# Altium project LimeSDR_1v2.PrjPcb (part 2 of 2)

## Sheet 13_Clocks.SchDoc: Clocks
size A3; Organization: Lime Microsystems; Address1: Surrey Tech Centre; Address2: Guildford GU2 7YG; Address3: Surrey; Address4: United Kingdom; Revision: v1.2; SheetNumber: 13; SheetTotal: 14
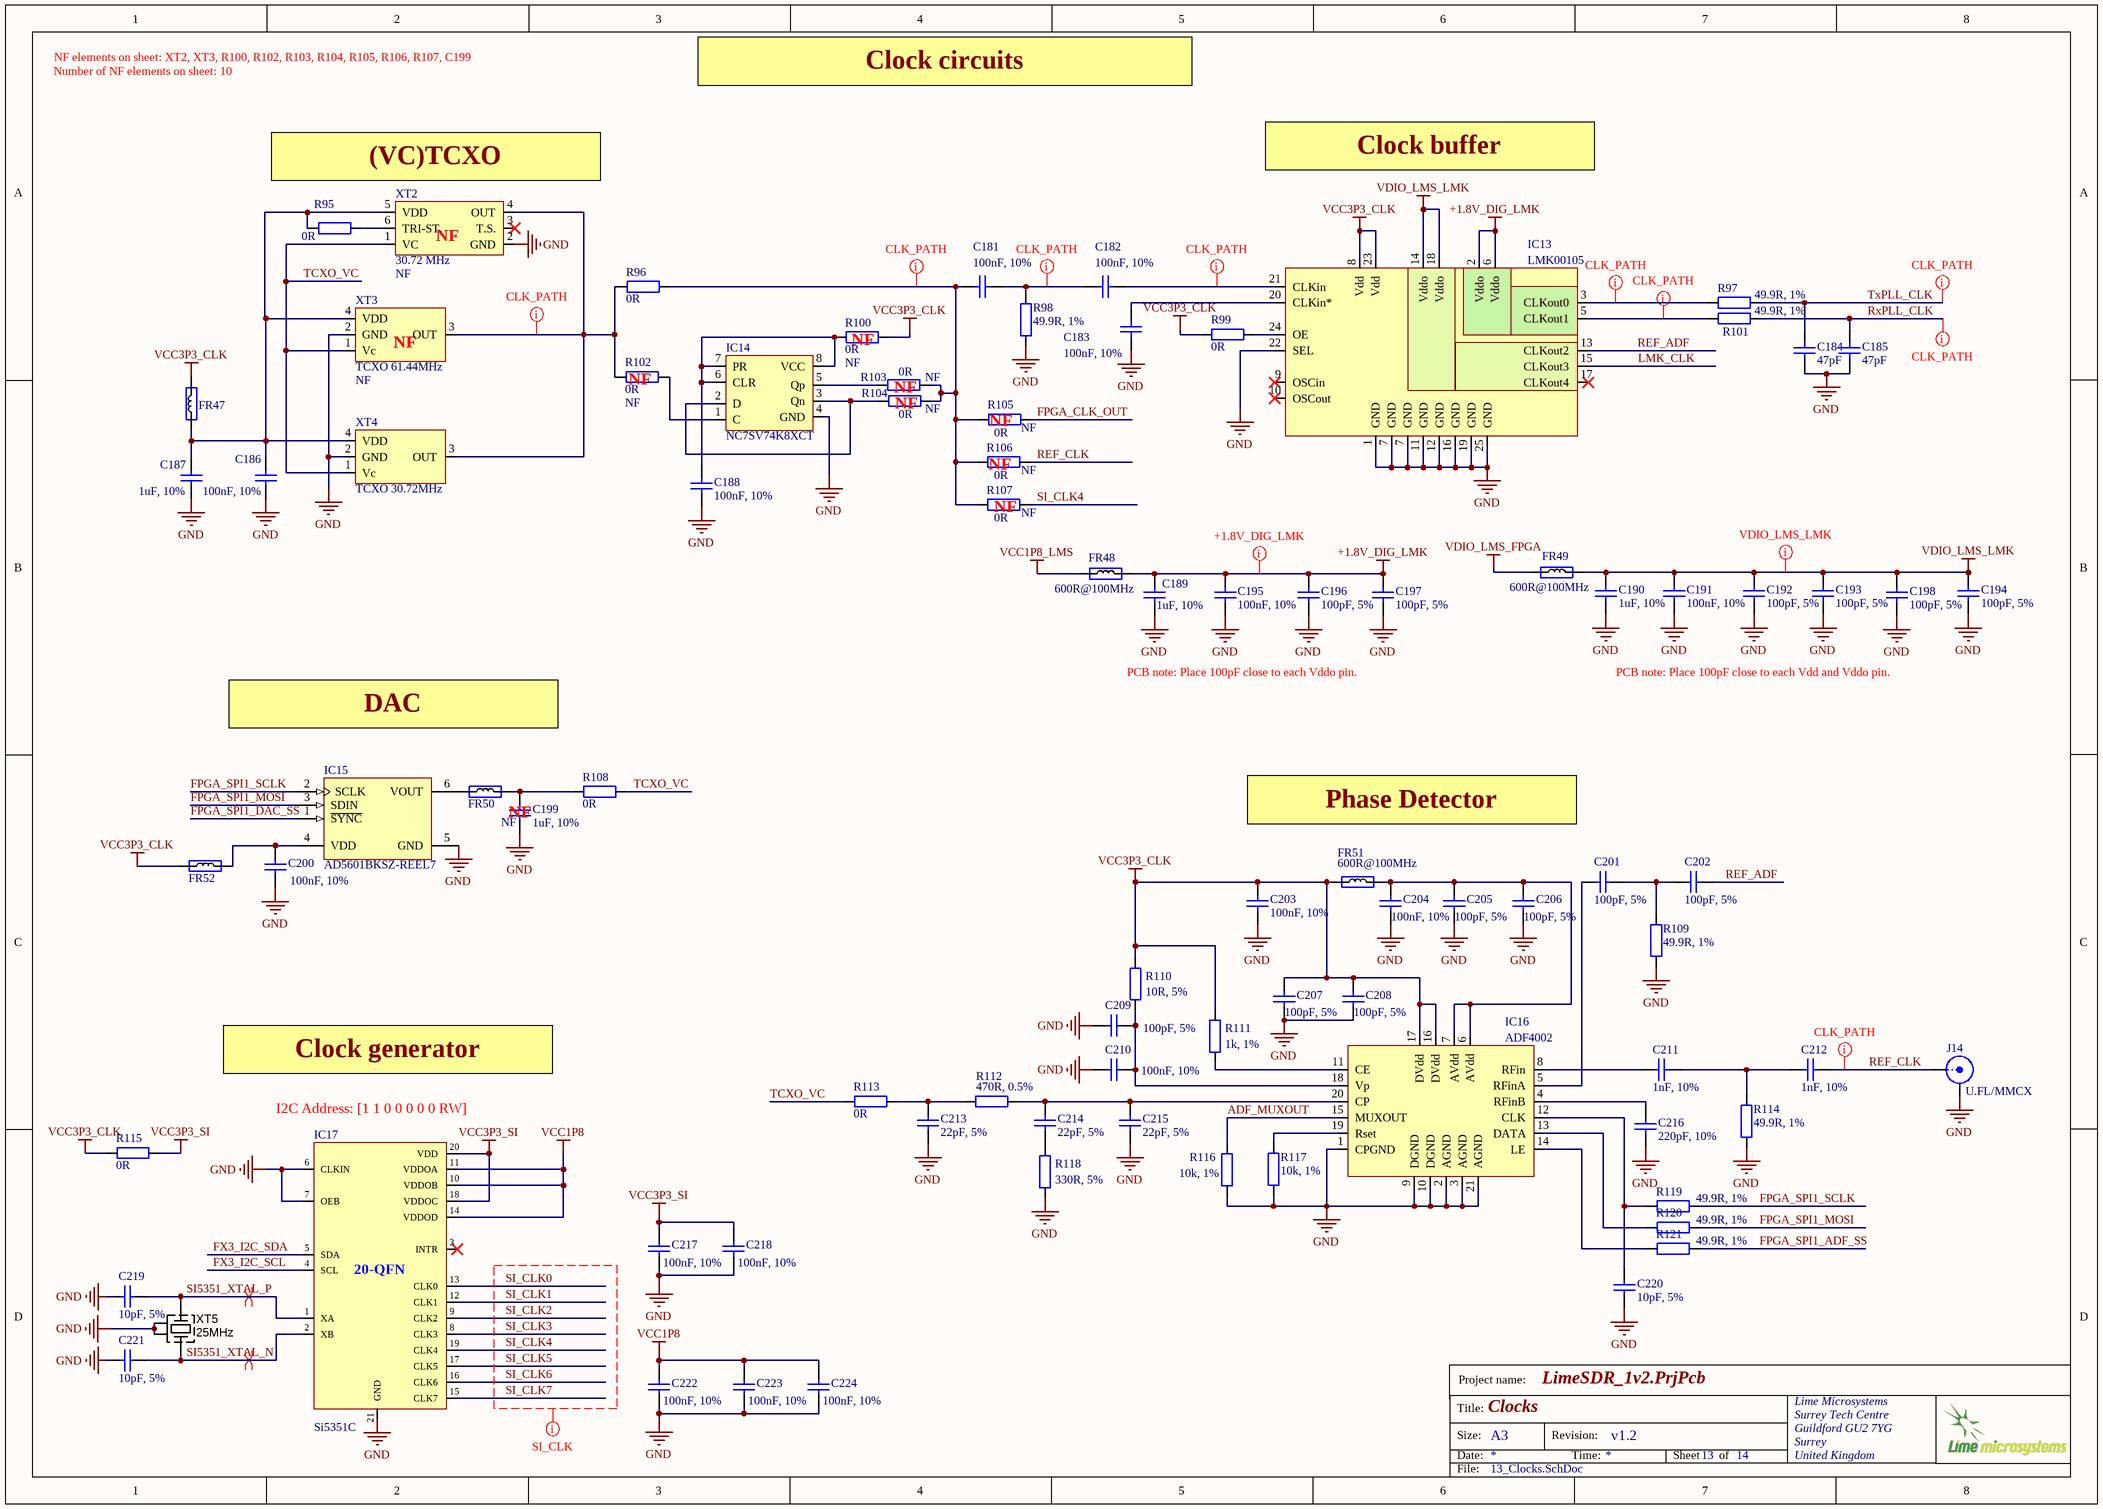
[diagram p7: 13_Clocks.SchDoc]

### Parts
C181  100nF, 10%  [CAP0402]
C182  100nF, 10%  [CAP0402]
C183  100nF, 10%  [CAP0402]
C184  47pF  [CAP0402]
C185  47pF  [CAP0402]
C186  100nF, 10%  [CAP0402]
C187  1uF, 10%  [CAP0402]
C188  100nF, 10%  [CAP0402]
C189  1uF, 10%  [CAP0402]
C190  1uF, 10%  [CAP0402]
C191  100nF, 10%  [CAP0402]
C192  100pF, 5%  [CAP0402]
C193  100pF, 5%  [CAP0402]
C194  100pF, 5%  [CAP0402]
C195  100nF, 10%  [CAP0402]
C196  100pF, 5%  [CAP0402]
C197  100pF, 5%  [CAP0402]
C198  100pF, 5%  [CAP0402]
C199  1uF, 10%  Assembly Info: NF  [CAP0402]
C200  100nF, 10%  [CAP0402]
C201  100pF, 5%  [CAP0402]
C202  100pF, 5%  [CAP0402]
C203  100nF, 10%  [CAP0402]
C204  100nF, 10%  [CAP0402]
C205  100pF, 5%  [CAP0402]
C206  100pF, 5%  [CAP0402]
C207  100pF, 5%  [CAP0402]
C208  100pF, 5%  [CAP0402]
C209  100pF, 5%  [CAP0402]
C210  100nF, 10%  [CAP0402]
C211  1nF, 10%  [CAP0402]
C212  1nF, 10%  [CAP0402]
C213  22pF, 5%  [CAP0402]
C214  22pF, 5%  [CAP0402]
C215  22pF, 5%  [CAP0402]
C216  220pF, 10%  [CAP0402]
C217  100nF, 10%  [CAP0402]
C218  100nF, 10%  [CAP0402]
C219  10pF, 5%  [CAP0402]
C220  10pF, 5%  [CAP0402]
C221  10pF, 5%  [CAP0402]
C222  100nF, 10%  [CAP0402]
C223  100nF, 10%  [CAP0402]
C224  100nF, 10%  [CAP0402]
FR47  Ferrite  [RES0201]  (value not drawn)
FR48  600R@100MHz  [RES0805]
FR49  600R@100MHz  [RES0805]
FR50  Ferrite  [RES0201]  (value not drawn)
FR51  600R@100MHz  [RES0805]
FR52  Ferrite  [RES0201]  (value not drawn)
IC13  LMK00105  [LMK00105SQ]
IC14  NC7SV74K8XCT  [NC7SV74K8XCT]
IC15  AD5601BKSZ-REEL7  [AD5601_SOT23-6]
IC16  ADF4002  [ADF4002]
IC17  Si5351C  [Si5351C_20QFN]
J14  U.FL/MMCX  [MMCX_UFL_conn_u]
R95  0R  [RES0402]
R96  0R  [RES0402]
R97  49.9R, 1%  [RES0402]
R98  49.9R, 1%  [RES0402]
R99  0R  [RES0402]
R100  0R  Assembly Info: NF  [RES0402]
R101  49.9R, 1%  [RES0402]
R102  0R  Assembly Info: NF  [RES0402]
R103  0R  Assembly Info: NF  [RES0402]
R104  0R  Assembly Info: NF  [RES0402]
R105  0R  Assembly Info: NF  [RES0402]
R106  0R  Assembly Info: NF  [RES0402]
R107  0R  Assembly Info: NF  [RES0402]
R108  0R  [RES0402]
R109  49.9R, 1%  [RES0402]
R110  10R, 5%  [RES0402]
R111  1k, 1%  [RES0402]
R112  470R, 0.5%  [RES0402]
R113  0R  [RES0402]
R114  49.9R, 1%  [RES0402]
R115  0R  [RES0402]
R116  10k, 1%  [RES0402]
R117  10k, 1%  [RES0402]
R118  330R, 5%  [RES0402]
R119  49.9R, 1%  [RES0402]
R120  49.9R, 1%  [RES0402]
R121  49.9R, 1%  [RES0402]
XT2  30.72 MHz  Assembly Info: NF  [RAKON_RPT7050A]
XT3  TCXO 61.44MHz  Assembly Info: NF  [RAKON_TXCO_61MHz_v2]
XT4  TCXO 30.72MHz  [RAKON_TXCO]
XT5  25MHz  [CRYSTAL_4-LCC]

### Nets
+1.8V_DIG_LMK: C189.2 C195.2 C196.2 C197.2 FR48.2 IC13.2(Vddo) IC13.6(Vddo)
GND: C183.1 C184.1 C185.1 C186.1 C187.1 C188.1 C189.1 C190.1 C191.1 C192.1 C193.1 C194.1 C195.1 C196.1 C197.1 C198.1 C199.1 C200.2 C203.1 C204.1 C205.2 C206.2 C207.2 C208.2 C209.1 C210.2 C213.1 C215.1 C216.2 C217.2 C218.2 C219.1 C220.1 C221.1 C222.2 C223.2 C224.2 IC13.1(GND) IC13.7(GND) IC13.11(GND) IC13.12(GND) IC13.16(GND) IC13.19(GND) IC13.22(SEL) IC13.25(GND) IC14.4(GND) IC15.5(GND) IC16.1(CPGND) IC16.2(AGND) IC16.3(AGND) IC16.9(DGND) IC16.10(DGND) IC16.21(AGND) IC17.6(CLKIN) IC17.7(OEB) IC17.21(GND) J14.2(Y) R98.1 R109.1 R114.1 R116.2 R117.2 R118.1 XT2.2(GND) XT3.2(GND) XT4.2(GND) XT5.2(GND) XT5.4(GND)
VCC1P8: C222.1 C223.1 C224.1 IC17.10(VDDOB) IC17.11(VDDOA) IC17.14(VDDOD)
VCC1P8_LMS: FR48.1
VCC3P3_CLK: C203.2 C207.1 C208.1 FR47.2 FR51.1 FR52.1 IC13.8(Vdd) IC13.23(Vdd) IC16.16(DVdd) IC16.17(DVdd) R99.1 R100.1 R110.2 R111.2 R115.2
VCC3P3_SI: C217.1 C218.1 IC17.18(VDDOC) IC17.20(VDD) R115.1
VDIO_LMS_FPGA: FR49.1
VDIO_LMS_LMK: C190.2 C191.2 C192.2 C193.2 C194.2 C198.2 FR49.2 IC13.14(Vddo) IC13.18(Vddo)
ADF_MUXOUT: IC16.15(MUXOUT) R116.1
FPGA_CLK_OUT: R105.1
FPGA_SPI1_ADF_SS: R121.1
FPGA_SPI1_DAC_SS: IC15.1(~{SYNC})
FPGA_SPI1_MOSI: IC15.3(SDIN) R120.1
FPGA_SPI1_SCLK: IC15.2(SCLK) R119.1
FX3_I2C_SCL: IC17.4(SCL)
FX3_I2C_SDA: IC17.5(SDA)
LMK_CLK: IC13.15(CLKout3)
REF_ADF: C202.2 IC13.13(CLKout2)
REF_CLK: C212.1 J14.1(X) R106.2
RxPLL_CLK: C185.2 R101.1
SI5351_XTAL_N: C221.2 IC17.2(XB) XT5.3(X)
SI5351_XTAL_P: C219.2 IC17.1(XA) XT5.1(X)
SI_CLK0: IC17.13(CLK0)
SI_CLK1: IC17.12(CLK1)
SI_CLK2: IC17.9(CLK2)
SI_CLK3: IC17.8(CLK3)
SI_CLK4: IC17.19(CLK4) R107.2
SI_CLK5: IC17.17(CLK5)
SI_CLK6: IC17.16(CLK6)
SI_CLK7: IC17.15(CLK7)
TCXO_VC: R108.1 R113.2 XT2.1(VC) XT3.1(Vc) XT4.1(Vc)
TxPLL_CLK: C184.2 R97.1
NetC181_1: C181.1 C182.2 R98.2
NetC181_2: C181.2 R96.1 R103.1 R104.1 R105.2 R106.1 R107.1
NetC182_1: C182.1 IC13.21(CLKin)
NetC183_2: C183.2 IC13.20(CLKin*)
NetC186_2: C186.2 C187.2 FR47.1 R95.2 XT2.5(VDD) XT3.4(VDD) XT4.4(VDD)
NetC188_2: C188.2 IC14.6(CLR) IC14.7(PR) IC14.8(VCC) R100.2
NetC199_2: C199.2 FR50.2 R108.2
NetC200_1: C200.1 FR52.2 IC15.4(VDD)
NetC201_1: C201.1 IC16.5(RFinA)
NetC201_2: C201.2 C202.1 R109.2
NetC204_2: C204.2 C205.1 C206.1 FR51.2 IC16.6(AVdd) IC16.7(AVdd)
NetC209_2: C209.2 C210.1 IC16.18(Vp) R110.1
NetC211_1: C211.1 C212.2 R114.2
NetC211_2: C211.2 IC16.8(RFin)
NetC213_2: C213.2 R112.2 R113.1
NetC214_1: C214.1 R118.2
NetC214_2: C214.2 C215.2 IC16.20(CP) R112.1
NetC216_1: C216.1 IC16.4(RFinB)
NetC220_2: C220.2 IC16.12(CLK) R119.2
NetFR50_1: FR50.1 IC15.6(VOUT)
NetIC13_3: IC13.3(CLKout0) R97.2
NetIC13_5: IC13.5(CLKout1) R101.2
NetIC13_24: IC13.24(OE) R99.2
NetIC14_1: IC14.1(C) R102.1
NetIC14_2: IC14.2(D) IC14.3(Qn) R104.2
NetIC14_5: IC14.5(Qp) R103.2
NetIC16_11: IC16.11(CE) R111.1
NetIC16_13: IC16.13(DATA) R120.2
NetIC16_14: IC16.14(LE) R121.2
NetIC16_19: IC16.19(Rset) R117.1
NetR95_1: R95.1 XT2.6(TRI-ST.)
NetR96_2: R96.2 R102.2 XT2.4(OUT) XT3.3(OUT) XT4.3(OUT)

Not connected (* = marked no-connect by the designer): IC13 9(OSCin)* 10(OSCout)* 17(CLKout4)*; IC17 3(INTR)*; XT2 3(T.S.)*

### Layout directives
net class CLK_PATH: NetC181_1, NetC181_2, NetC182_1, NetIC13_3, NetIC13_5, NetR96_2, REF_CLK, RxPLL_CLK, TxPLL_CLK
net class SI_CLK: SI_CLK0, SI_CLK1, SI_CLK2, SI_CLK3, SI_CLK4, SI_CLK5, SI_CLK6, SI_CLK7
differential pair: SI5351_XTAL_N, SI5351_XTAL_P
net class +1.8V_DIG_LMK: +1.8V_DIG_LMK
net class VDIO_LMS_LMK: VDIO_LMS_LMK

### Notes on the sheet
- Number of NF elements on sheet: 10
- NF elements on sheet: XT2, XT3, R100, R102, R103, R104, R105, R106, R107, C199
- Clock circuits
- (VC)TCXO
- Clock buffer
- (near XT2) NF
- (near XT3) NF
- (near R102) NF
- (near R100) NF
- NF
- (near R104) NF
- (near R105) NF
- (near R106) NF
- (near R107) NF
- PCB note: Place 100pF close to each Vddo pin.
- PCB note: Place 100pF close to each Vdd and Vddo pin.
- DAC
- (near C199) NF
- Phase Detector
- Clock generator
- (near IC17) I2C Address: [1 1 0 0 0 0 0 RW]
- Project name:
- Title:
- Size:
- Date:
- A3
- Revision:
- Time:
- Sheet
- of
- File:
- (in symbol Si5351C) 20-QFN

### Library data of the parts
C181-C183 C186 C188 C191 C195 C203 C204 C210 = Cap_0402: Manufacturer: Murata Electronics; Manufacturer Part Number: GRM155R71C104KA88D; Part Description: 0.10µF ±10% 16V X7R Ceramic Capacitor -55°C ~ 125°C Surface Mount, MLCC 0402 (1005 Metric) 0.039" L x 0.020" W (1.00mm x 0.50mm); Voltage Rating DC: 16 V; Type: General Purpose MLCC; Capacitance: 0.1 uF; Case Length: 1 mm; Dielectric: X7R; Case Height: 0.5 mm; Temperature Coefficient / Code: +/- 15 %; Value: 100nF, 10%; Supplier 1: Mouser; Supplier Part Number 1: 81-GRM155R71C104KA88; Case Code - in: 0402; RoHS: RoHS Compliant; Operating Temperature Range: - 55 C to + 125 C; Series: GRM; Termination Style: SMD/SMT; Tolerance: 10 %; Package / Case: 0402 (1005 metric); Maximum Operating Temperature: + 125 C; Case Code - mm: 1005; Minimum Operating Temperature: - 55 C; Product Category: Low & Medium Capacitance SMD Ceramic Chip Capacitors; Packaging: Reel; Product: General Type MLCCs; Category: Multilayer Ceramic Capacitors MLCC - SMD/SMT; Brand: Murata Electronics; Case Width: 0.5 mm; RoHS - Mouser: Y; Standard Pack Qty: 10000; Minimum Order Quantity: 1; Reeling: True; Manufacturer Part Number 1: GRM155R71C104KA88D
C184 C185 = Cap_0402: Manufacturer Part Number 1: C1005C0G1H470F050BA; Manufacturer: TDK Corporation; Part Description: 47pF ±1% 50V C0G, NP0 Ceramic Capacitor -55°C ~ 125°C Surface Mount, MLCC 0402 (1005 Metric) 0.039" L x 0.020" W (1.00mm x 0.50mm); Voltage - Rated: 50V; Temperature Coefficient: C0G, NP0; Tolerance: ±1%; Value: 47pF; Supplier 1: Digi-Key; Supplier Part Number 1: 445-5361-1-ND; Package / Case: 0402 (1005 Metric); Lead Spacing: -; Ratings: -; Mounting Type: Surface Mount, MLCC; Operating Temperature: -55°C ~ 125°C; Thickness (Max): 0.022" (0.55mm); Capacitance: 47pF; Packaging: Cut Tape (CT); Features: -; Applications: General Purpose; Lead Style: -; Size / Dimension: 0.039" L x 0.020" W (1.00mm x 0.50mm); Height - Seated (Max): -; RoHS: RoHS Compliant; Category: Capacitors
C187 C189 C190 C199 = Cap_0402: Manufacturer Part Number 1: GRM155R61A105KE15J; Manufacturer: TDK; Part Description: 1µF ±10% 10V X5R Ceramic Capacitor -55°C ~ 85°C Surface Mount, MLCC 0402 (1005 Metric) 0.039" L x 0.020" W (1.00mm x 0.50mm); Voltage Rating: 10; Product Range: TDK - C Series; Ceramic Capacitor Case: 0402 [1005 Metric]; Capacitance: 1; Dielectric Characteristic: X6; Value: 1uF, 10%; Supplier 1: Newark; Supplier Part Number 1: 490-6298-2-ND; Capacitance Tolerance: ± 10%; MSL: -; RoHS: YES
C192-C194 C196-C198 = Cap_0402: Manufacturer Part Number 1: CC0402JRNPO9BN101; Manufacturer: Yageo; Part Description: 100pF ±5% 50V C0G, NP0 Ceramic Capacitor -55°C ~ 125°C Surface Mount, MLCC 0402 (1005 Metric) 0.039" L x 0.020" W (1.00mm x 0.50mm); Voltage - Rated: 50V; Temperature Coefficient: C0G, NP0; Value: 100pF, 5%; Supplier 1: Digi-Key; Supplier Part Number 1: 311-1024-1-ND; RoHS: RoHS Compliant; Category: Capacitors; Applications: General Purpose; Mounting Type: Surface Mount, MLCC; Capacitance: 100pF; Ratings: -; Packaging: Cut Tape (CT); Size / Dimension: 0.039" L x 0.020" W (1.00mm x 0.50mm); Height - Seated (Max): -; Package / Case: 0402 (1005 Metric); Operating Temperature: -55°C ~ 125°C; Features: -; Tolerance: ±5%; Lead Spacing: -; Lead Style: -; Thickness (Max): 0.022" (0.55mm)
C200 C217 C218 C222-C224 = Cap_0603: Manufacturer Part Number 1: GRM155R71C104KA88D; Part Description: 0.10µF ±10% 16V X7R Ceramic Capacitor -55°C ~ 125°C Surface Mount, MLCC 0402 (1005 Metric) 0.039" L x 0.020" W (1.00mm x 0.50mm); Brand: Murata Electronics; Type: General Purpose MLCC; Capacitance: 0.1 uF; Temperature Coefficient / Code: +/- 15 %; Voltage Rating DC: 16 V; Supplier 1: Mouser; Supplier Part Number 1: 81-GRM155R71C104KA88; Tolerance: 10 %; Case Code - in: 0402; Manufacturer: Murata Electronics; Category: Multilayer Ceramic Capacitors MLCC - SMD/SMT; Value: 100nF, 10%; Manufacturer Part Number: GRM155R71C104KA88D
C201 C202 C205-C209 = Cap_0402: Manufacturer: Yageo; Manufacturer Part Number 1: CC0402JRNPO9BN101; Part Description: 100pF ±5% 50V C0G, NP0 Ceramic Capacitor -55°C ~ 125°C Surface Mount, MLCC 0402 (1005 Metric) 0.039" L x 0.020" W (1.00mm x 0.50mm); Voltage - Rated: 50V; Temperature Coefficient: C0G, NP0; Value: 100pF, 5%; Supplier 1: Digi-Key; Supplier Part Number 1: 311-1024-1-ND; Category: Capacitors; Features: -; Operating Temperature: -55°C ~ 125°C; Capacitance: 100pF; Thickness (Max): 0.022" (0.55mm); RoHS: RoHS Compliant; Lead Style: -; Ratings: -; Size / Dimension: 0.039" L x 0.020" W (1.00mm x 0.50mm); Height - Seated (Max): -; Applications: General Purpose; Package / Case: 0402 (1005 Metric); Lead Spacing: -; Packaging: Tape & Reel (TR); Mounting Type: Surface Mount, MLCC; Tolerance: ±5%
C211 C212 = Cap_0402: Manufacturer Part Number 1: GCM155R71H102KA37D; Part Description: 1000pF ±10% 50V X7R Ceramic Capacitor -55°C ~ 125°C Surface Mount, MLCC 0402 (1005 Metric) 0.039" L x 0.020" W (1.00mm x 0.50mm); Capacitance: 1000 pF; Type: Automotive Ultra Small MLCC; Brand: Murata Electronics; Case Height: 0.5 mm; Case Length: 1 mm; Dielectric: X7R; Voltage Rating DC: 50 V; Temperature Coefficient / Code: +/- 15 %; Value: 1nF, 10%; Supplier 1: Mouser; Supplier Part Number 1: 81-GCM155R71H102KA7D; Case Code - in: 0402; Package / Case: 0402 (1005 metric); Tolerance: 10 %; Termination Style: SMD/SMT; Packaging: Reel; Operating Temperature Range: - 55 C to + 125 C; Maximum Operating Temperature: + 125 C; Manufacturer: Murata Electronics; Category: Multilayer Ceramic Capacitors MLCC - SMD/SMT; RoHS: RoHS Compliant; Series: GCM; Case Width: 0.5 mm; Case Code - mm: 1005; Product: Automotive MLCCs; Standard Pack Qty: 10000; Reeling: True; RoHS - Mouser: Y; Minimum Order Quantity: 1; Product Category: Automotive Ceramic Chip Capacitors; Minimum Operating Temperature: - 55 C
C213-C215 = Cap_0402: Manufacturer: Yageo; Manufacturer Part Number 1: CC0402JRNPO9BN220; Part Description: 22pF ±5% 50V C0G, NP0 Ceramic Capacitor -55°C ~ 125°C Surface Mount, MLCC 0402 (1005 Metric) 0.039" L x 0.020" W (1.00mm x 0.50mm); Voltage - Rated: 50V; Temperature Coefficient: C0G, NP0; Value: 22pF, 5%; Supplier 1: Digi-Key; Supplier Part Number 1: 311-1018-2-ND; Tolerance: ±5%; Category: Capacitors; Packaging: Tape & Reel (TR); RoHS: RoHS Compliant; Capacitance: 22pF; Operating Temperature: -55°C ~ 125°C; Mounting Type: Surface Mount, MLCC; Height - Seated (Max): -; Size / Dimension: 0.039" L x 0.020" W (1.00mm x 0.50mm); Ratings: -; Applications: General Purpose; Thickness (Max): 0.022" (0.55mm); Lead Spacing: -; Lead Style: -; Features: -; Package / Case: 0402 (1005 Metric)
C216 = Cap_0402: Manufacturer Part Number 1: CC0402KRX7R9BB221; Manufacturer: Yageo; Part Description: 220pF ±10% 50V X7R Ceramic Capacitor -55°C ~ 125°C Surface Mount, MLCC 0402 (1005 Metric) 0.039" L x 0.020" W (1.00mm x 0.50mm); Temperature Coefficient: X7R; Voltage - Rated: 50V; Value: 220pF, 10%; Supplier 1: Digi-Key; Supplier Part Number 1: 311-1035-2-ND; Category: Capacitors; Ratings: -; RoHS: RoHS Compliant; Packaging: Tape & Reel (TR); Mounting Type: Surface Mount, MLCC; Applications: General Purpose; Capacitance: 220pF; Tolerance: ±10%; Operating Temperature: -55°C ~ 125°C; Package / Case: 0402 (1005 Metric); Lead Spacing: -; Size / Dimension: 0.039" L x 0.020" W (1.00mm x 0.50mm); Thickness (Max): 0.022" (0.55mm); Height - Seated (Max): -; Lead Style: -; Features: -
C219 C221 = Cap_0402: Manufacturer: AVX; Capacitance: 10; Ceramic Capacitor Case: 0402 [1005 Metric]; Supplier 1: Farnell; Supplier Part Number 1: 2332478RL; Capacitance Tolerance: ± 5%; value: 10pF, 5%
C220 = Cap_0402: Manufacturer Part Number 1: 04023A100JAT2A; Manufacturer: AVX; Part Description: 10pF ±5% 25V C0G, NP0, Ceramic Capacitor, Surface Mount, MLCC 0402; Voltage Rating: 25; Ceramic Capacitor Case: 0402 [1005 Metric]; Capacitor Case Style: 0402 [1005 Metric]<!--FANDB--><div class="features-and-benefits-container"></div>; Dielectric Characteristic: C0G / NP0; SVHC: No SVHC (16-Jun-2014); Capacitance: 10; Value: 10pF, 5%; Supplier 1: Farnell; Supplier Part Number 1: 2332478RL; Capacitance Tolerance: ± 5%; Product Range: -; RoHS: YES; Operating Temperature Min: -55; Operating Temperature Max: 125; Capacitance Tolerance ±: ± 5%; MSL: MSL 1 - Unlimited; Packaging: Cut Tape
FR47 FR50 FR52 = Ferrite: Manufacturer Part Number 1: BK0603TS601-T; Manufacturer: Taiyo Yuden; Part Description: FERRITE BEAD 600 OHM 0201 1LN; DC Resistance (DCR): 750 mOhm Max; Filter Type: Differential Mode - Single; Impedance @ Frequency: 600 Ohm @ 100MHz; Current Rating: 270mA; Value: 600R@100MHz; Supplier 1: Digi-Key; Supplier Part Number 1: 587-3277-1-ND; Size / Dimension: 0.024" L x 0.012" W (0.60mm x 0.30mm); Package / Case: 0201 (0603 Metric); Height (Max): 0.013" (0.33mm); Mounting Type: Surface Mount; Packaging: Cut Tape (CT); RoHS: RoHS Compliant; Category: Filters
FR48 FR49 FR51 = Ferrite: Manufacturer Part Number 1: MPZ2012S601AT000; Manufacturer: TDK Corporation; Part Description: FERRITE BEAD 600 OHM 0805 1LN; Filter Type: Differential Mode - Single; Impedance @ Frequency: 600 Ohm @ 100MHz; DC Resistance (DCR): 100 mOhm Max; Current Rating: 2A; Supplier 1: Digi-Key; Supplier Part Number 1: 445-2206-2-ND; Mounting Type: Surface Mount; RoHS: RoHS Compliant; Height (Max): 0.041" (1.05mm); Packaging: Tape & Reel (TR); Category: Filters; Package / Case: 0805 (2012 Metric); Size / Dimension: 0.079" L x 0.049" W (2.00mm x 1.25mm)
IC13 = LMK00105: Manufacturer: Texas Instruments; Manufacturer Part Number 1: LMK00105SQ/NOPB; Part Description: IC CLK BUFFER 2:5 200MHZ 24WQFN; Frequency - Max: 200MHz; Voltage - Supply: 2.375 V ~ 3.45 V; Input: HCSL, LVCMOS, LVDS, LVPECL, LVTTL, SSTL, Crystal; Differential - Input:Output: Yes/No; Supplier 1: Digi-Key; Type: Fanout Buffer (Distribution), Multiplexer, Translator; Category: Integrated Circuits (ICs); Operating Temperature: -40°C ~ 85°C; Package / Case: 24-WFQFN Exposed Pad; Supplier Device Package: 24-WQFN (4x4); Supplier Part Number 1: LMK00105SQ/NOPBCT-ND
IC14 = NC7SV74K8XCT: Manufacturer: Fairchild Semiconductor; Part Description: IC D-TYPE POS TRG SNGL US8; Max Propagation Delay @ V, Max CL: 2.8ns @ 3.3V, 30pF; Frequency - Clock: 200MHz; Current - Output High, Low: 24mA, 24mA; Current - Quiescent: 0.9µA; Number of Bits per Element: 1; Trigger Type: Positive Edge; Output Type: Differential; Function: Set(Preset) and Reset; Input Capacitance: 2pF; Voltage - Supply: 0.9 V ~ 3.6 V; Supplier 1: Digi-Key; Operating Temperature: -40°C ~ 85°C (TA); Mounting Type: Surface Mount; Package / Case: 8-VFSOP (0.091", 2.30mm Width); Packaging: Cut Tape (CT); Number of Elements: 1; Manufacturer Part Number 1: NC7SV74K8X; RoHS: RoHS Compliant; Type: D-Type; Category: Integrated Circuits (ICs); Supplier Part Number 1: NC7SV74K8XCT-ND
IC15 = AD5601BKSZ-REEL7: Single 8-Bit nanoDAC with SPI Interface in LFCSP and SC70, 2.7 to 5.5 V, <100 uA, -40 to +125 degC, KS-6, Pb-Free, Reel; Generic Part Number: AD5601; Manufacturer: Analog Devices; Part Description: IC DAC 8BIT BUFF V-OUT SC70-6; # DAC Outputs: 1; Max V+: 5.5V; Op Pwr Diss: 550µW; Resolution (Bits): 8; Settling Time: 6µs; Single Supply: Yes; DatasheetVersion: Rev.F; PackageVersion: 072809-A; PackageReference: KS-6; PackageDescription: 6-Lead Thin Shrink Small Outline Transistor Package [SC70]; Supplier 1: Digi-Key; Supplier Part Number 1: AD5601BKSZ-REEL7TR-ND; Supplier 2: Digi-Key; Supplier Part Number 2: AD5601BKSZ-REEL7CT-ND; Supplier 3: Digi-Key; Supplier Part Number 3: AD5601BKSZ-REEL7DKR-ND; Supplier 4: Farnell; Supplier Part Number 4: 2312971; Supplier 5: Newark; Supplier Part Number 5: 59K4256; Supplier 6: Newark; Supplier Part Number 6: 67W3160; Supplier 7: Mouser; Supplier Part Number 7: 584-AD5601BKSZ-R7; Packing: Reel; RoHS: Y; Mounting Technology: Surface Mount; Code_JEDEC: MO-203-AB; PartNumber: AD5601BKSZ-REEL7; ComponentLink1Description: Manufacturer URL; ComponentLink1URL: http://www.analog.com/en/index.html; ComponentLink2Description: Datasheet; ComponentLink2URL: http://www.analog.com/static/imported-files/data_sheets/AD5601_5611_5621.pdf; ComponentLink3Description: Package Specification; ComponentLink3URL: http://www.analog.com/static/imported-files/packages/PKG_PDF/SC70(KS)/KS_6.pdf; ComponentLink4Description: Product URL; ComponentLink4URL: http://www.analog.com/en/digital-to-analog-converters/da-converters/ad5601/products/product.html
IC16 = ADF4002: Manufacturer: Analog Devices Inc; Manufacturer Part Number 1: ADF4002BCPZ-RL7; Part Description: IC PLL FREQUENCY SYNTH 20-LFCSP; Ratio - Input:Output: 2:1; Differential - Input:Output: Yes/No; Input: CMOS, TTL; Voltage - Supply: 2.7 V ~ 3.3 V; Supplier 1: Digi-Key; Supplier: Digi-Key; Category: Integrated Circuits (ICs); Type: Clock/Frequency Synthesizer (RF), Phase Detector; Operating Temperature: -40°C ~ 85°C; Mounting Type: Surface Mount; Package / Case: 20-VFQFN Exposed Pad, CSP; Supplier Part Number 1: ADF4002BCPZ-RL7CT-ND
IC17 = Si5351C: Manufacturer Part Number 1: SI5351C-B-GM; Part Description: IC CLK GENERATOR 200MHZ 20QFN; Manufacturer: Silicon Labs; Voltage - Supply: 1.71 V ~ 3.6 V; Input: Clock, Crystal; Ratio - Input:Output: 2:8; Frequency - Max: 160MHz; Supplier 1: Digi-Key; Supplier Device Package: 20-QFN (4x4); Type: Clock Generator; Package / Case: 20-VFQFN Exposed Pad; Category: Integrated Circuits (ICs); Supplier Part Number 1: 336-2402-ND
J14 = RF_IF_connector: Manufacturer: Molex, LLC; Manufacturer Part Number 1: 0734120110; Part Description: CONN UMC RCPT STR 50 OHM SMD; Shield Termination: Solder; Frequency - Max: 6GHz; Impedance: 50 Ohm; Center Contact Material: Brass; Connector Style: Ultra Miniature Coaxial; Connector Type: Jack, Male Pin; Dielectric Material: Liquid Crystal Polymer (LCP); Center Contact Plating: Gold; Body Finish: Nickel; Body Material: Phosphor Bronze; Voltage Rating: 60V; Supplier 1: Digi-Key; Supplier Part Number 1: WM5587CT-ND; Ingress Protection: -; Category: Connectors, Interconnects; Mounting Type: Surface Mount; Packaging: Cut Tape (CT); Operating Temperature: -40°C ~ 90°C; Housing Color: Silver; Features: -; RoHS: RoHS Compliant; Cable Group: -; Fastening Type: Snap-On; Contact Termination: Solder
R95 R96 R99 R100 R102-R108 R113 R115 = Res_0402: Manufacturer Part Number 1: RC0402JR-070RL; Manufacturer: Yageo; Part Description: RES SMD 0.0OHM JUMPER 1/16W 0402; Resistance (Ohms): 0.0; Tolerance: Jumper; Power (Watts): 0.063W, 1/16W; Value: 0R; Supplier 1: Digi-Key; Supplier Part Number 1: 311-0.0JRTR-ND; Category: Resistors; Temperature Coefficient: -; Features: Moisture Resistant; Supplier Device Package: 0402; Height: 0.016" (0.40mm); Package / Case: 0402 (1005 Metric); Operating Temperature: -55°C ~ 155°C; Size / Dimension: 0.039" L x 0.020" W (1.00mm x 0.50mm); Composition: Thick Film; Packaging: Tape & Reel (TR); Number of Terminations: 2; RoHS: RoHS Compliant
R97 R98 R101 R109 R114 R119-R121 = Res_0402: Manufacturer: Samsung Electro-Mechanics America, Inc.; Manufacturer Part Number: RC1005F49R9CS; Part Description: RES SMD 49.9 OHM 1% 1/16W 0402; Temperature Coefficient: ±100ppm/°C; Resistance (Ohms): 49.9; Power (Watts): 0.063W, 1/16W; Number of Terminations: 2; Size / Dimension: 0.039" L x 0.020" W (1.00mm x 0.50mm); Supplier Device Package: 0402 (1005 Metric); RoHS: RoHS Compliant; Supplier Part Number 1: 1276-3469-6-ND; Features: -; Packaging: Digi-Reel®; Tolerance: ±1%; Height: 0.016" (0.40mm); Category: Resistors; Composition: Thick Film; Package / Case: 0402 (1005 Metric); Supplier 1: Digi-Key; Operating Temperature: -55°C ~ 155°C; Value: 49.9R, 1%
R110 = Res_0402: Manufacturer Part Number 1: RC0402JR-0710RL; Manufacturer: Yageo; Part Description: RES SMD 10 OHM 5% 1/16W 0402; Power (Watts): 0.063W, 1/16W; Resistance (Ohms): 10; Temperature Coefficient: ±200ppm/°C; Value: 10R, 5%; Supplier 1: Digi-Key; Supplier Part Number 1: 311-10JRTR-ND; Number of Terminations: 2; Height: 0.016" (0.40mm); RoHS: RoHS Compliant; Composition: Thick Film; Packaging: Tape & Reel (TR); Category: Resistors; Supplier Device Package: 0402; Features: Moisture Resistant; Tolerance: ±5%; Operating Temperature: -55°C ~ 155°C; Size / Dimension: 0.039" L x 0.020" W (1.00mm x 0.50mm); Package / Case: 0402 (1005 Metric)
R111 = Res_0402: Manufacturer: Stackpole Electronics Inc; Manufacturer Part Number 1: RMCF0402FT1K00; Part Description: RES SMD 1K OHM 1% 1/16W 0402; Temperature Coefficient: ±100ppm/°C; Power (Watts): 0.063W, 1/16W; Value: 1k, 1%; Supplier 1: Digi-Key; Supplier Part Number 1: RMCF0402FT1K00TR-ND; Resistance (Ohms): 1k; Packaging: Tape & Reel (TR); Category: Resistors; RoHS: RoHS Compliant; Tolerance: ±1%; Height: 0.016" (0.40mm); Number of Terminations: 2; Package / Case: 0402 (1005 Metric); Operating Temperature: -55°C ~ 155°C; Features: -; Composition: Thick Film; Supplier Device Package: 0402; Size / Dimension: 0.039" L x 0.020" W (1.00mm x 0.50mm)
R112 = Res_0402: Manufacturer: Panasonic Electronic Components; Manufacturer Part Number 1: ERA-2AED471X; Part Description: RES SMD 470 OHM 0.5% 1/16W 0402; Power (Watts): 0.063W, 1/16W; Temperature Coefficient: ±25ppm/°C; Resistance (Ohms): 470; Value: 470R, 0.5%; Supplier 1: Digi-Key; Supplier Part Number 1: P470DETR-ND; Tolerance: ±0.5%; Packaging: Tape & Reel (TR); Number of Terminations: 2; Operating Temperature: -55°C ~ 155°C; RoHS: RoHS Compliant; Size / Dimension: 0.039" L x 0.020" W (1.00mm x 0.50mm); Composition: Thin Film; Package / Case: 0402 (1005 Metric); Height: 0.016" (0.40mm); Features: Automotive AEC-Q200; Supplier Device Package: 0402; Category: Resistors
R116 R117 = Res_0402: Manufacturer: Yageo; Manufacturer Part Number 1: RC0402FR-0710KL; Part Description: RES SMD 10K OHM 1% 1/16W 0402; Temperature Coefficient: ±100ppm/°C; Power (Watts): 0.063W, 1/16W; Value: 10k, 1%; Supplier 1: Digi-Key; Supplier Part Number 1: 311-10.0KLRTR-ND; Resistance (Ohms): 10k; Packaging: Tape & Reel (TR); RoHS: RoHS Compliant; Package / Case: 0402 (1005 Metric); Tolerance: ±1%; Operating Temperature: -55°C ~ 155°C; Size / Dimension: 0.039" L x 0.020" W (1.00mm x 0.50mm); Number of Terminations: 2; Category: Resistors; Height: 0.016" (0.40mm); Supplier Device Package: 0402; Features: Moisture Resistant; Composition: Thick Film
R118 = Res_0402: Manufacturer: Yageo; Manufacturer Part Number 1: RC0402JR-07330RL; Part Description: RES SMD 330 OHM 5% 1/16W 0402; Power (Watts): 0.063W, 1/16W; Resistance (Ohms): 330; Temperature Coefficient: ±100ppm/°C; Value: 330R, 5%; Supplier 1: Digi-Key; Supplier Part Number 1: 311-330JRTR-ND; Composition: Thick Film; Supplier Device Package: 0402; Package / Case: 0402 (1005 Metric); Size / Dimension: 0.039" L x 0.020" W (1.00mm x 0.50mm); Features: Moisture Resistant; Height: 0.016" (0.40mm); Packaging: Tape & Reel (TR); RoHS: RoHS Compliant; Tolerance: ±5%; Category: Resistors; Number of Terminations: 2; Operating Temperature: -55°C ~ 155°C
XT2 = RPT7050A: Manufacturer Part Number 1: E6245LF; Part Description: TCXO 30.72MHz, E6245LF; Manufacturer: Rakon; Supplier 1: Rakon; Supplier Part Number 1: E6245LF
XT3 = TXCO: Manufacturer Part Number 1: E5405LF; Part Description: TCXO 61.44MHz, E5405LF; Manufacturer: Rakon; Supplier Part Number 1: E5405LF; Supplier 1: Rakon
XT4 = TXCO: Manufacturer Part Number 1: E5280LF; Part Description: TCXO 30.72MHz, E5280LF; Manufacturer: Rakon; Supplier 1: Rakon; Supplier Part Number 1: E5280LF
XT5 = CRYSTAL_19M2: Oscillator Crystal 25 MHz; Manufacturer Part Number 1: ABM8-25.000MHZ-B2-T; Manufacturer: ABRACON; Part Description: 25MHz ±20ppm Crystal 18pF 50 Ohm -20°C ~ 70°C Surface Mount 4-SMD, No Lead (DFN, LCC); Supplier 1: Newark; Supplier Part Number 1: 13J1767

## Nets that join several sheets
GND: 04_LMS7002M_Digital (12 pins), 05_LMS7002M_RF (34 pins), 06_LMS7002M_Power (59 pins), 07_FPGA_banks_1_2_3_4 (12 pins), 12_USB3_0_power (54 pins), 13_Clocks (68 pins)
VCC1P8: 12_USB3_0_power (FR38.1), 13_Clocks (6 pins)
VCC1P8_LMS: 05_LMS7002M_RF (16 pins), 06_LMS7002M_Power (11 pins), 13_Clocks (FR48.1)
VCC3P3_CLK: 12_USB3_0_power (FR40.2), 13_Clocks (15 pins)
VDIO_LMS: 04_LMS7002M_Digital (14 pins), 06_LMS7002M_Power (5 pins)
RxPLL_CLK: 04_LMS7002M_Digital (R1.2), 13_Clocks (C185.2 R101.1)
TxPLL_CLK: 04_LMS7002M_Digital (R4.2), 13_Clocks (C184.2 R97.1)